# EAGLE design Sensors (EAGLE 9.6.2)
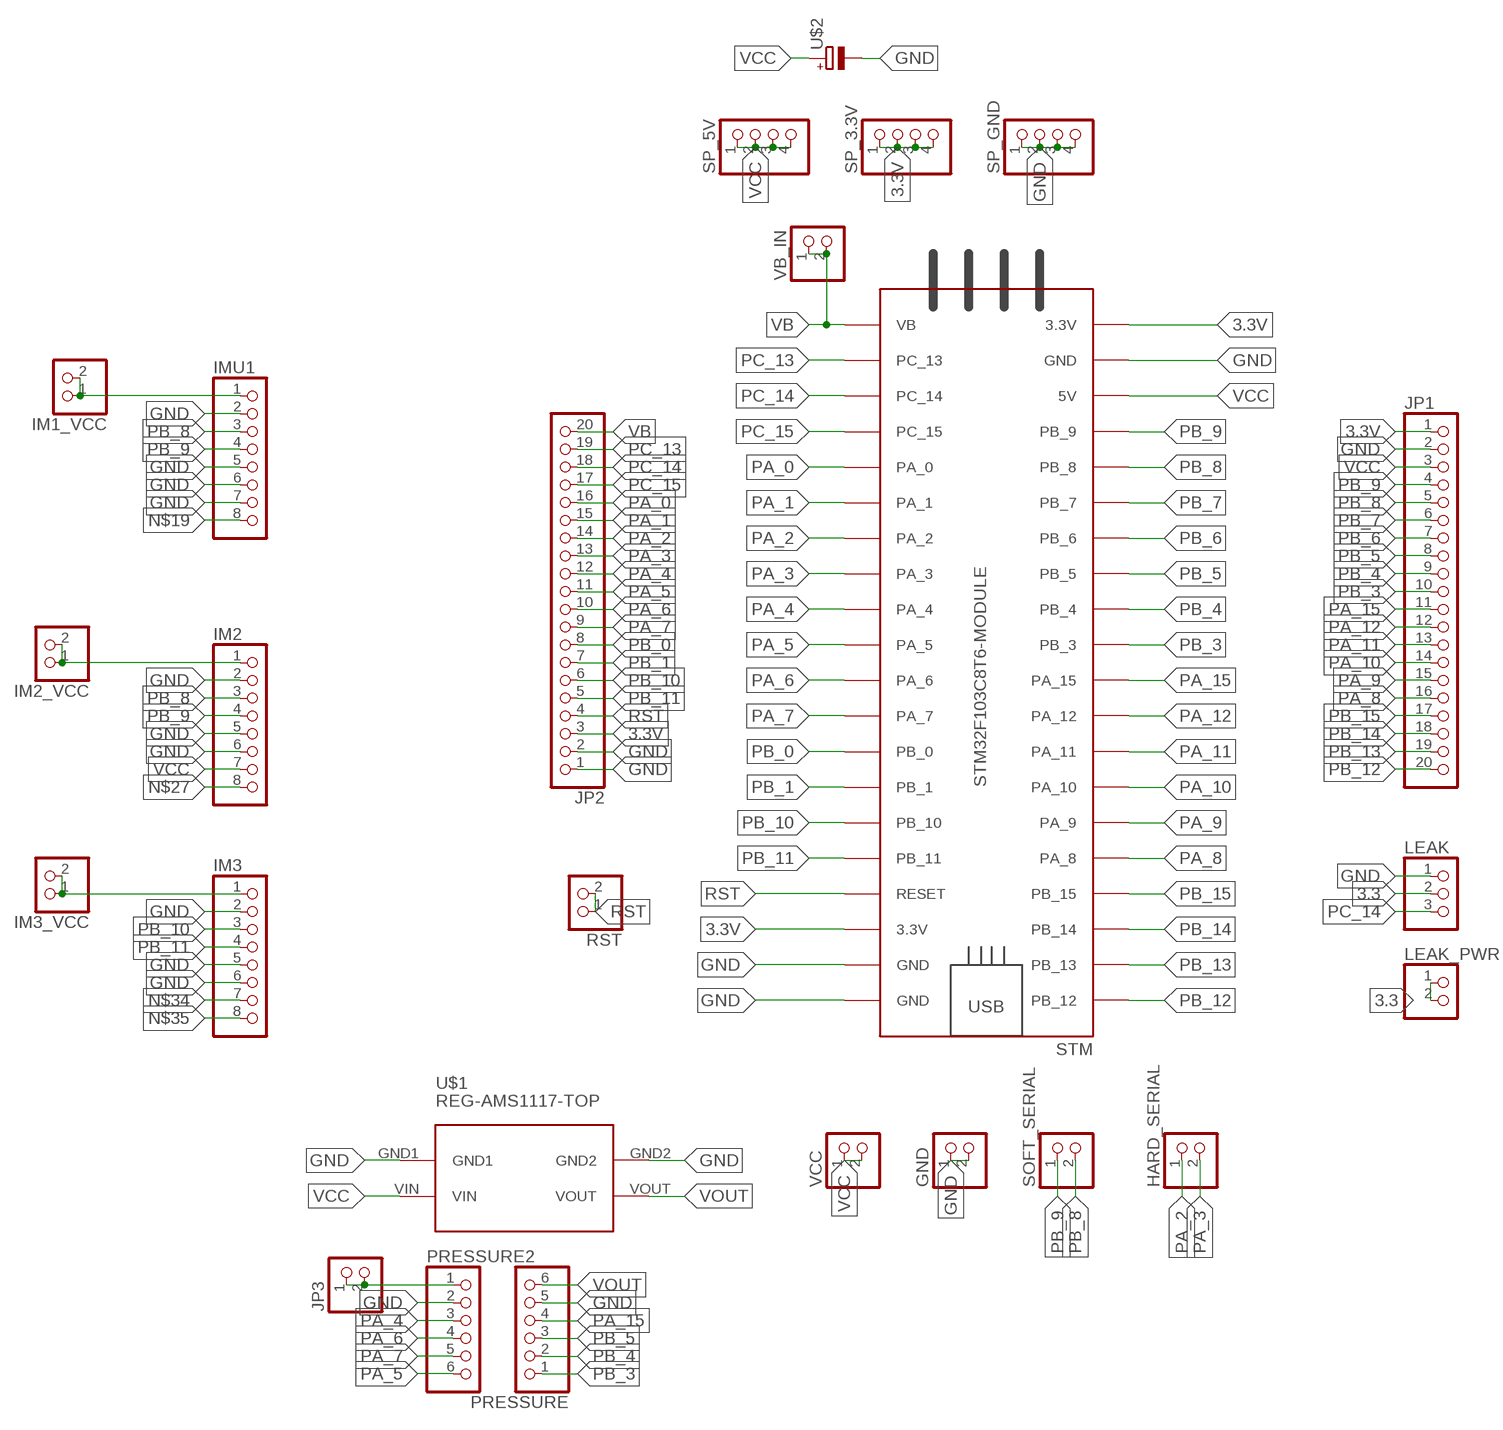
[diagram p0: schematic, sheet 1]

## Parts
GND  PINHD-2_DATA  [1X02_DATA]
HARD_SERIAL  PINHD-2_DATA  [1X02_DATA]
IM1_VCC  PINHD-2_DATA  [1X02_DATA]
IM2  PINHD-8_DATA  [1X08_DATA]
IM2_VCC  PINHD-2_DATA  [1X02_DATA]
IM3  PINHD-8_DATA  [1X08_DATA]
IM3_VCC  PINHD-2_DATA  [1X02_DATA]
IMU1  PINHD-8_DATA  [1X08_DATA]
JP1  PINHD-1X20  [1X20]
JP2  PINHD-1X20  [1X20]
JP3  PINHD-2_DATA  [1X02_DATA]
LEAK  PINHD-3_DATA  [1X03_DATA]
LEAK_PWR  PINHD-2_DATA  [1X02_DATA]
PRESSURE  PINHD-6_DATA  [1X06_DATA]
PRESSURE2  PINHD-6_DATA  [1X06_DATA]
RST  PINHD-2_DATA  [1X02_DATA]
SOFT_SERIAL  PINHD-2_DATA  [1X02_DATA]
SP_3.3V  PINHD-1X4  [1X04]
SP_5V  PINHD-1X4  [1X04]
SP_GND  PINHD-1X4  [1X04]
STM  STM32F103C8T6-MODULE  [STM32F103C8T6-MODULE]
U$1  REG-AMS1117-TOP  [REG-AMS1117_TOP]
U$2  CAP_POL  [E3,5-8]
VB_IN  PINHD-2_DATA  [1X02_DATA]
VCC  PINHD-2_DATA  [1X02_DATA]

## Nets
3.3: LEAK.2 LEAK_PWR.1 LEAK_PWR.2
3.3V: JP1.1 JP2.3 SP_3.3V.1 SP_3.3V.2 SP_3.3V.3 SP_3.3V.4 STM.3.3V_1(3.3V) STM.3.3V_2(3.3V)
GND: GND.1 GND.2 IM2.2 IM2.5 IM2.6 IM3.2 IM3.5 IM3.6 IMU1.2 IMU1.5 IMU1.6 IMU1.7 JP1.2 JP2.1 JP2.2 LEAK.1 PRESSURE2.2 PRESSURE.5 SP_GND.1 SP_GND.2 SP_GND.3 SP_GND.4 STM.GND_1(GND) STM.GND_2(GND) STM.GND_3(GND) U$1.GND1 U$1.GND2 U$2.-
N$2: IM2.1 IM2_VCC.1 IM2_VCC.2
N$3: IM1_VCC.1 IM1_VCC.2 IMU1.1
N$11: IM3.1 IM3_VCC.1 IM3_VCC.2
N$19: IMU1.8
N$27: IM2.8
N$34: IM3.7
N$35: IM3.8
NS: JP3.1 JP3.2 PRESSURE2.1
PA_0: JP2.16 STM.PA_0
PA_1: JP2.15 STM.PA_1
PA_2: HARD_SERIAL.1 JP2.14 STM.PA_2
PA_3: HARD_SERIAL.2 JP2.13 STM.PA_3
PA_4: JP2.12 PRESSURE2.3 STM.PA_4
PA_5: JP2.11 PRESSURE2.6 STM.PA_5
PA_6: JP2.10 PRESSURE2.4 STM.PA_6
PA_7: JP2.9 PRESSURE2.5 STM.PA_7
PA_8: JP1.16 STM.PA_8
PA_9: JP1.15 STM.PA_9
PA_10: JP1.14 STM.PA_10
PA_11: JP1.13 STM.PA_11
PA_12: JP1.12 STM.PA_12
PA_15: JP1.11 PRESSURE.4 STM.PA_15
PB_0: JP2.8 STM.PB_0
PB_1: JP2.7 STM.PB_1
PB_3: JP1.10 PRESSURE.1 STM.PB_3
PB_4: JP1.9 PRESSURE.2 STM.PB_4
PB_5: JP1.8 PRESSURE.3 STM.PB_5
PB_6: JP1.7 STM.PB_6
PB_7: JP1.6 STM.PB_7
PB_8: IM2.3 IMU1.3 JP1.5 SOFT_SERIAL.2 STM.PB_8
PB_9: IM2.4 IMU1.4 JP1.4 SOFT_SERIAL.1 STM.PB_9
PB_10: IM3.3 JP2.6 STM.PB_10
PB_11: IM3.4 JP2.5 STM.PB_11
PB_12: JP1.20 STM.PB_12
PB_13: JP1.19 STM.PB_13
PB_14: JP1.18 STM.PB_14
PB_15: JP1.17 STM.PB_15
PC_13: JP2.19 STM.PC_13
PC_14: JP2.18 LEAK.3 STM.PC_14
PC_15: JP2.17 STM.PC_15
RST: JP2.4 RST.1 RST.2 STM.RESET
VB: JP2.20 STM.VB VB_IN.1 VB_IN.2
VCC: IM2.7 JP1.3 SP_5V.1 SP_5V.2 SP_5V.3 SP_5V.4 STM.5V U$1.VIN U$2.+ VCC.1 VCC.2
VOUT: PRESSURE.6 U$1.VOUT

## Library data of the parts
GND HARD_SERIAL IM1_VCC IM2_VCC IM3_VCC JP3 LEAK_PWR RST SOFT_SERIAL VB_IN VCC = MIA_LIBRARY-2-2-2:PINHD-2_DATA: PIN HEADER
IM2 IM3 IMU1 = MIA_LIBRARY-2-2-2:PINHD-8_DATA: PIN HEADER
JP1 JP2 = MIA_LIBRARY-2-2-2:PINHD-1X20: PIN HEADER
LEAK = MIA_LIBRARY-2-2-2:PINHD-3_DATA: PIN HEADER
PRESSURE PRESSURE2 = MIA_LIBRARY-2-2-2:PINHD-6_DATA: PIN HEADER
SP_3.3V SP_5V SP_GND = MIA_LIBRARY-2-2-2:PINHD-1X4: PIN HEADER
STM = MIA_LIBRARY-2-2-2:STM32F103C8T6-MODULE: STM32F103C8T6 module with ARM Cortex-3, 20kB SRAM, 64kB Flash, 72MHz
U$1 = MIA_LIBRARY-2-2-2:REG-AMS1117-TOP: Linear Regulator based on AMS1117 chip
U$2 = MIA_LIBRARY-2-2-2:CAP_POL

## Board
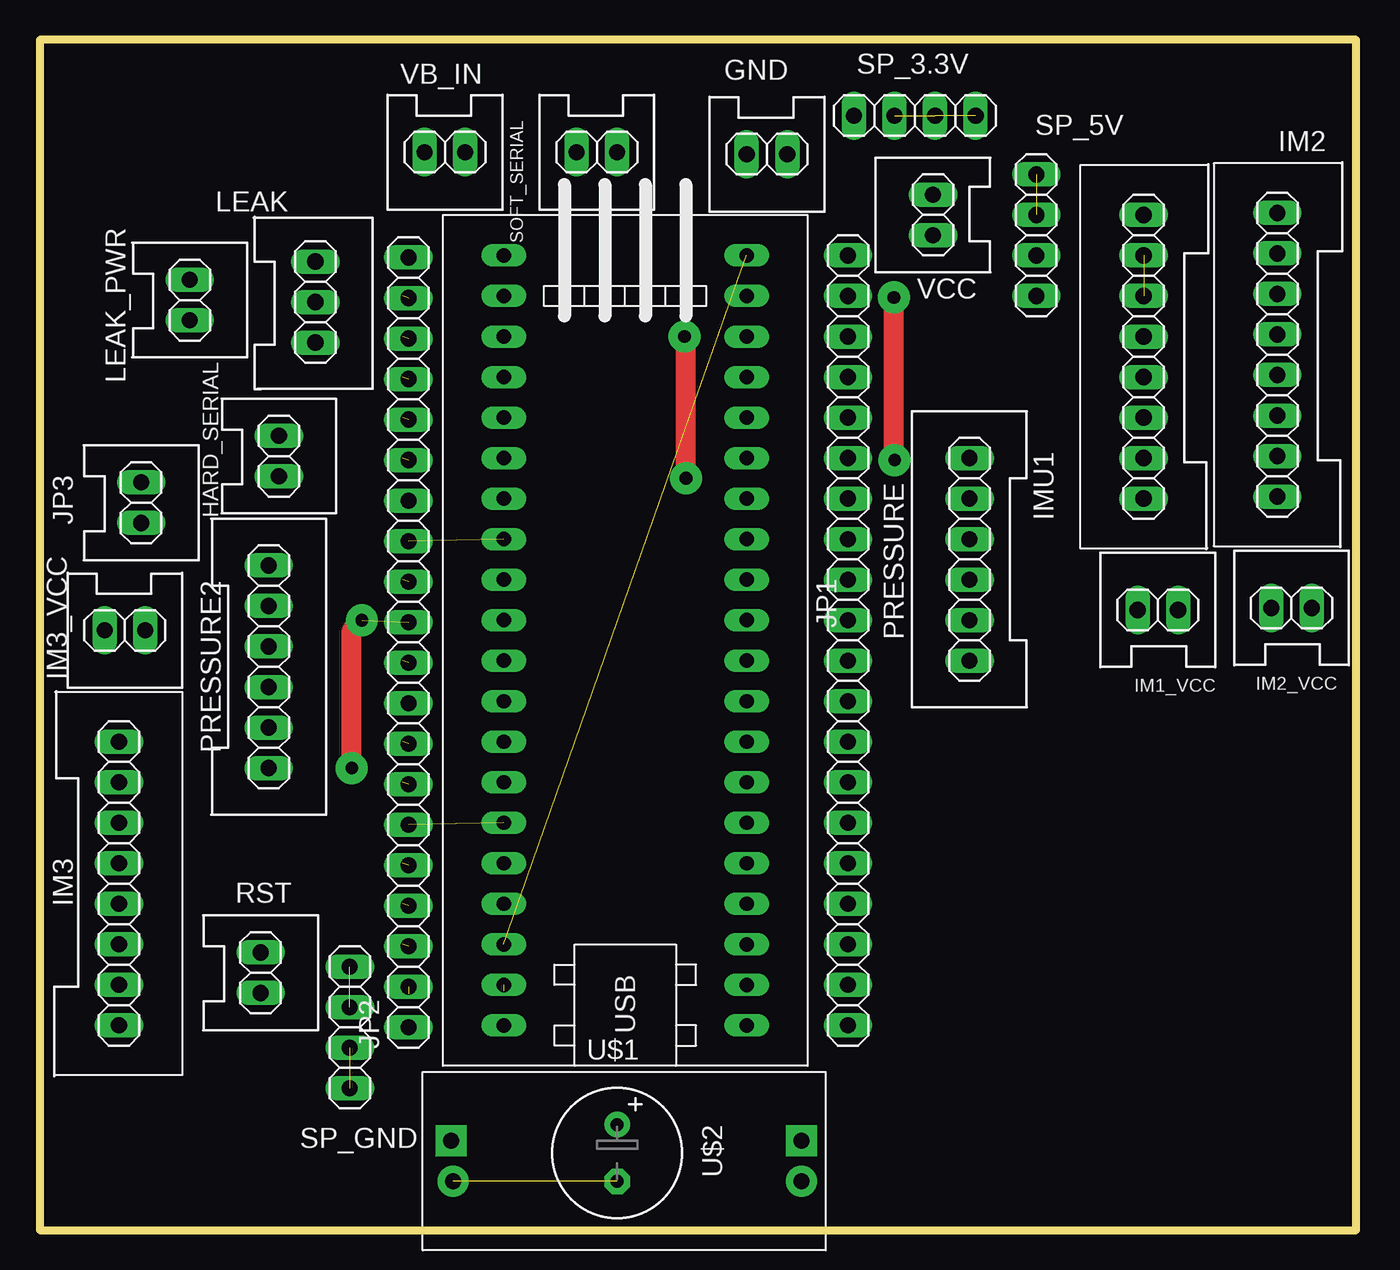
[diagram p1: board, top side]
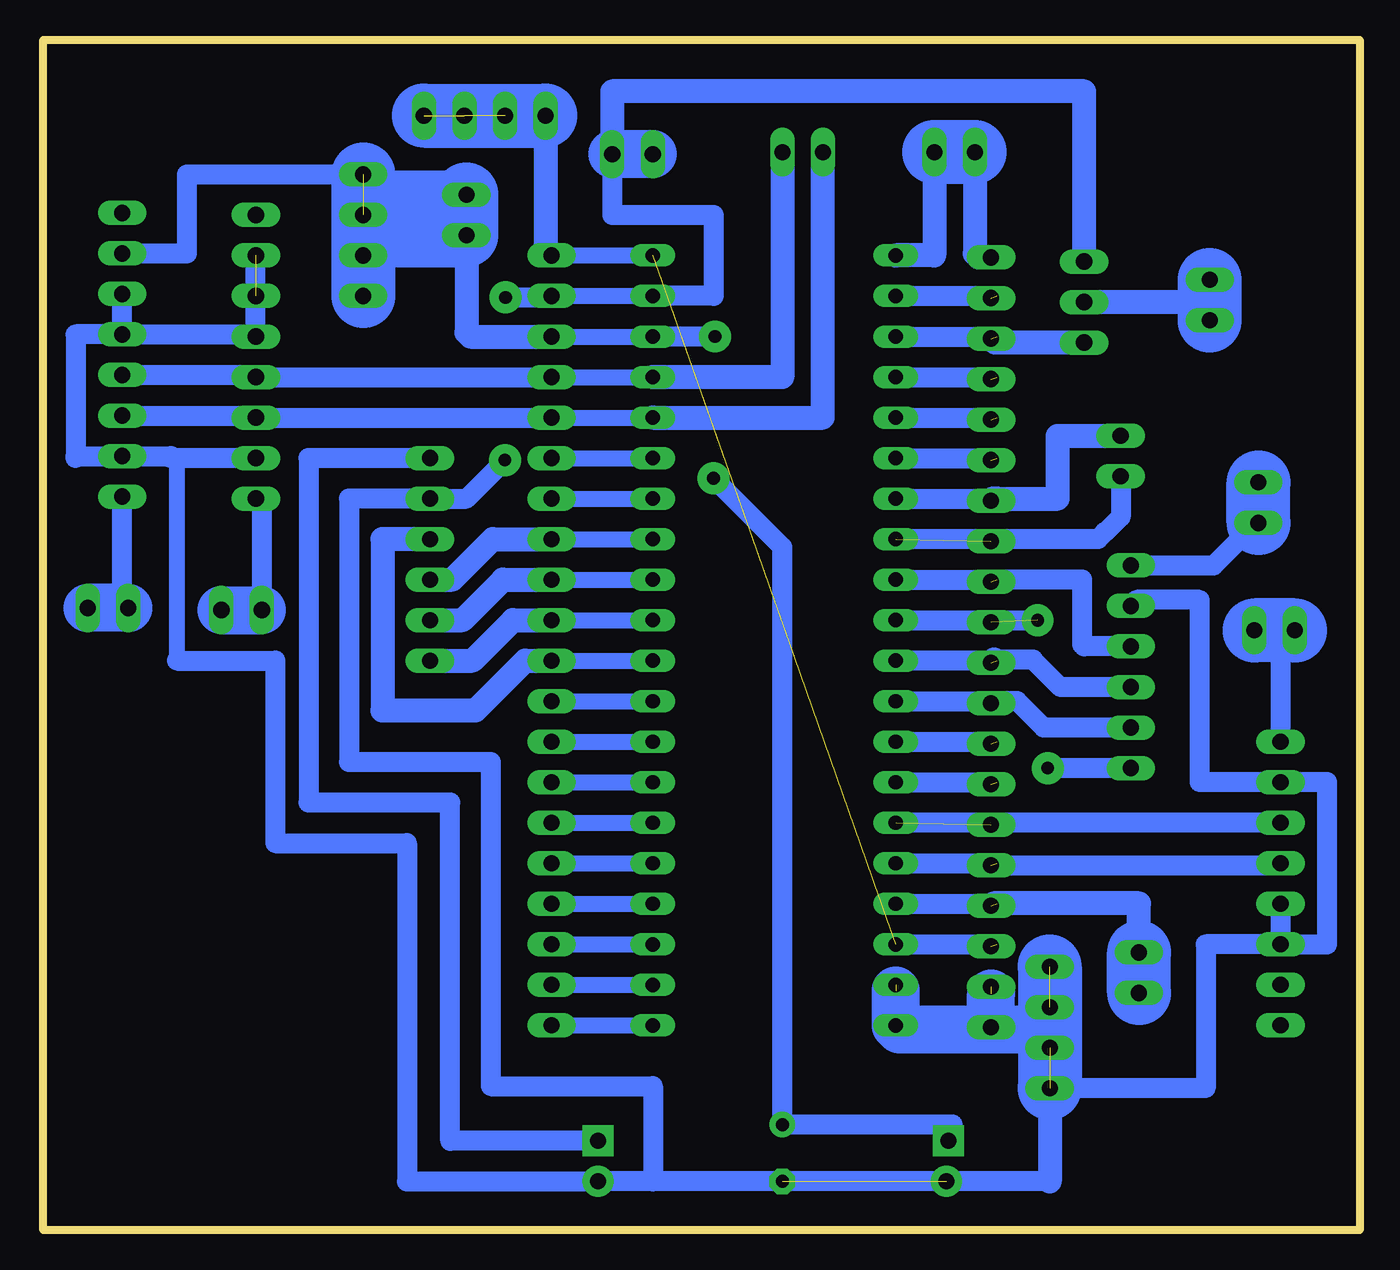
[diagram p2: board, bottom side, seen from below]

Size 82.53 x 74.6 mm. Coordinates in mm from the lower left corner, seen from the top.
Outline: 0,0 82.53,0 82.53,74.6 0,74.6 0,0
Copper layers (1*16): Top 0.035mm / dielectric 1.5mm / Bottom 0.035mm
Design rules "default *": minimum track width 1mm, minimum drill 0.35mm, track to track 0.7mm, track to pad 0.7mm, pad to pad 6mil, via to via 6mil, smd to smd 6mil, copper to edge 40mil, drill to drill 6mil, minimum pad ring 10mil, minimum via ring 8mil, stop-mask expansion 4mil, vias tented up to drill 0mil, thermal gap 10mil

### Footprints (pad centres in the part's own frame; a part is rotated, then mirrored left to right if it is on the bottom)
1X02_DATA = drill 1.016 long: 1 -1.27,0; 2 1.27,0
1X08_DATA = drill 1.016 long: 1 -8.89,0; 2 -6.35,0; 3 -3.81,0; 4 -1.27,0; 5 1.27,0; 6 3.81,0; 7 6.35,0; 8 8.89,0
1X20 = drill 1.016 long: 1 -24.13,0; 2 -21.59,0; 3 -19.05,0; 4 -16.51,0; 5 -13.97,0; 6 -11.43,0; 7 -8.89,0; 8 -6.35,0; 9 -3.81,0; 10 -1.27,0; 11 1.27,0; 12 3.81,0; 13 6.35,0; 14 8.89,0; 15 11.43,0; 16 13.97,0; 17 16.51,0; 18 19.05,0; 19 21.59,0; 20 24.13,0
1X03_DATA = drill 1.016 long: 1 -2.54,0; 2 0,0; 3 2.54,0
1X06_DATA = drill 1.016 long: 1 -6.35,0; 2 -3.81,0; 3 -1.27,0; 4 1.27,0; 5 3.81,0; 6 6.35,0
1X04 = drill 1.016 long: 1 -3.81,0; 2 -1.27,0; 3 1.27,0; 4 3.81,0
STM32F103C8T6-MODULE = drill 0.9 long: 3.3V_1 25.4,-7.62; 3.3V_2 -17.78,7.62; 5V 20.32,-7.62; GND_1 22.86,-7.62; GND_2 -20.32,7.62; GND_3 -22.86,7.62; PA_0 15.24,7.62; PA_1 12.7,7.62; PA_2 10.16,7.62; PA_3 7.62,7.62; PA_4 5.08,7.62; PA_5 2.54,7.62; PA_6 0,7.62; PA_7 -2.54,7.62; PA_8 -12.7,-7.62; PA_9 -10.16,-7.62; PA_10 -7.62,-7.62; PA_11 -5.08,-7.62; PA_12 -2.54,-7.62; PA_15 0,-7.62; PB_0 -5.08,7.62; PB_1 -7.62,7.62; PB_3 2.54,-7.62; PB_4 5.08,-7.62; PB_5 7.62,-7.62; PB_6 10.16,-7.62; PB_7 12.7,-7.62; PB_8 15.24,-7.62; PB_9 17.78,-7.62; PB_10 -10.16,7.62; PB_11 -12.7,7.62; PB_12 -22.86,-7.62; PB_13 -20.32,-7.62; PB_14 -17.78,-7.62; PB_15 -15.24,-7.62; PC_13 22.86,7.62; PC_14 20.32,7.62; PC_15 17.78,7.62; RESET -15.24,7.62; VB 25.4,7.62
REG-AMS1117_TOP = drill 1 pad 1.93: GND1 -13.843,-1.27; GND2 8.001,-1.27 | drill 1 pad 1.93 square: VIN -13.97,1.27; VOUT 8.001,1.27
E3,5-8 = drill 0.813 pad 1.6: + -1.778,0 | drill 0.813 pad 1.6 octagon: - 1.778,0

### Placement (x,y rotation side)
GND  45.59,67.44 180 top
HARD_SERIAL  14.99,48.51 270 top
IM1_VCC  70.1,38.86 0 top
IM2  77.6,54.86 90 top
IM2_VCC  78.49,38.99 0 top
IM3  4.95,21.72 270 top
IM3_VCC  5.33,37.59 180 top
IMU1  69.22,54.74 90 top
JP1  50.67,36.96 270 top
JP2  23.11,36.83 90 top
JP3  6.35,45.59 270 top
LEAK  17.27,58.17 270 top
LEAK_PWR  9.4,58.29 270 top
PRESSURE  58.29,42.04 90 top
PRESSURE2  14.35,35.31 270 top
RST  13.84,16.13 270 top
SOFT_SERIAL  34.92,67.56 180 top
SP_3.3V  54.86,69.85 180 top
SP_5V  62.48,62.36 90 top
SP_GND  19.43,12.7 90 top
STM  36.7,35.69 90 top
U$1  39.75,4.32 0 top
U$2  36.2,4.83 270 top
VB_IN  25.4,67.56 180 top
VCC  56.01,63.63 90 top

### Tracks (layer width: path | path; a pad name or v marks a point on that pad's centre or on a via)
3.3
  Bottom 1.5: LEAK_PWR.1 9.4,58.17 LEAK.2
  Bottom 4: LEAK_PWR.2 LEAK_PWR.1
3.3V  (4 unrouted)
  Bottom 1: JP1.1 STM.3.3V_1
  Bottom 1.25: STM.3.3V_2 22.73,17.91
  Bottom 1.5: SP_3.3V.4 51.05,61.47 JP1.1
  Bottom 4: SP_3.3V.1 SP_3.3V.4
GND  (via drill 0.8 pad 2)  (6 unrouted)
  Top 1.25: v53.59,48.26 53.56,48.3 v53.56,58.46
  Bottom 1: JP1.2 STM.GND_1 | 74.55,48.51 74.55,48.39 | 74.17,48.39 74.17,35.69
  Bottom 1.25: 19.43,3.05 U$1.GND1 44.32,3.05 | 44.32,3.05 U$1.GND2 59.73,3.05 59.73,24.26 67.99,24.26 67.99,35.69 74.17,35.69 | 44.32,3.05 44.32,9.02 54.48,9.02 54.48,29.34 63.37,29.34 63.37,45.85 PRESSURE.5 56.01,45.85 v53.59,48.26 | IMU1.2 74.17,48.39 74.55,48.39 | IMU1.7 IMU1.5 69.34,56.13 IM2.5 | 74.55,48.51 IM2.2 80.52,48.51 | IM2.5 IM2.6 | IM2.5 80.52,56.13 80.52,48.39 | IM3.6 IM3.5 | IM3.6 2.03,17.91 2.03,28.07 IM3.2 10.03,28.07 10.03,39.5 13.97,39.5 PRESSURE2.2 | IM3.6 9.65,17.91 9.65,8.89 SP_GND.1 | GND.1 46.86,63.63 40.51,63.63 40.51,58.55 STM.GND_1 | v53.56,58.46 50.76,58.46 JP1.2
  Bottom 1.5: SP_GND.1 19.43,3.05 | LEAK.1 17.27,71.37 46.86,71.37 GND.1
  Bottom 3: SP_GND.2 20.57,12.57 20.57,12.7 20.45,12.57 22.99,12.57 | 22.99,12.57 JP2.1 23.11,14.82 | 22.99,12.57 28.83,12.57 STM.GND_3 29.08,15 | GND.2 GND.1
  Bottom 4: SP_GND.4 SP_GND.1
N$2
  Bottom 1.25: IM2_VCC.2 77.6,38.99 IM2.1
  Bottom 3: IM2_VCC.1 IM2_VCC.2
N$3
  Bottom 1.25: IMU1.1 68.83,45.47 IM1_VCC.1
  Bottom 3: IM1_VCC.2 IM1_VCC.1
N$11
  Bottom 1.25: IM3.1 4.95,36.7 IM3_VCC.2
  Bottom 4: IM3_VCC.2 IM3_VCC.1
NS
  Bottom 1.25: PRESSURE2.1 9.14,41.66 6.48,44.32 JP3.2 6.22,44.45 6.22,44.58 6.35,44.7 JP3.1
  Bottom 4: JP3.2 JP3.1
PA_0  (1 unrouted)
  Bottom 1.25: STM.PA_0 22.73,50.93
PA_1  (1 unrouted)
  Bottom 1.25: STM.PA_1 22.73,48.39
PA_2
  Bottom 1.25: STM.PA_2 22.73,45.85
  Bottom 1.5: JP2.14 22.99,45.85 22.73,45.85 18.92,45.85 18.92,49.78 HARD_SERIAL.1
PA_3  (1 unrouted)
  Bottom 1.25: HARD_SERIAL.2 14.99,44.7 15.95,43.74 15.98,43.74 16.41,43.31 STM.PA_3
PA_4  (1 unrouted)
  Bottom 1.25: STM.PA_4 22.73,40.77 | PRESSURE2.3 17.27,36.58 17.4,36.7 17.4,40.77 22.99,40.77 JP2.12
PA_5  (via drill 0.8 pad 2)  (1 unrouted)
  Top 1.25: v19.56,28.96 19.56,37.59 v20.19,38.23
  Bottom 1.25: STM.PA_5 v20.19,38.23 | PRESSURE2.6 v19.56,28.96
PA_6  (1 unrouted)
  Bottom 1.25: 14.42,34.11 PRESSURE2.4 18.76,34.04 20.47,35.75 22.92,35.75 | 22.73,35.69 STM.PA_6
  Bottom 1.5: 22.92,35.75 JP2.10
PA_7
  Bottom 1.25: 22.99,33.15 JP2.9 | 22.99,33.15 21.46,33.15 19.81,31.5 PRESSURE2.5 | STM.PA_7 22.99,33.15
PA_8
  Bottom 1: JP1.16 STM.PA_8
PA_9
  Bottom 1: JP1.15 STM.PA_9
PA_10
  Bottom 1: JP1.14 STM.PA_10
PA_11
  Bottom 1: JP1.13 STM.PA_11
PA_12
  Bottom 1: JP1.12 STM.PA_12
PA_15
  Bottom 1: JP1.11 STM.PA_15
  Bottom 1.5: JP1.11 52.32,35.69 55.45,32.56 61.27,32.56 61.27,43.31 PRESSURE.4
PB_0  (1 unrouted)
  Bottom 1.25: STM.PB_0 22.73,30.61
PB_1  (1 unrouted)
  Bottom 1.25: STM.PB_1 22.73,28.07
PB_3
  Bottom 1: JP1.10 STM.PB_3
  Bottom 1.5: PRESSURE.1 55.63,35.69 53.09,38.23 JP1.10
PB_4
  Bottom 1: JP1.9 STM.PB_4
  Bottom 1.5: PRESSURE.2 56.26,38.23 53.72,40.77 JP1.9
PB_5
  Bottom 1: JP1.8 STM.PB_5
  Bottom 1.5: PRESSURE.3 56.9,40.77 54.36,43.31 JP1.8
PB_6
  Bottom 1: JP1.7 STM.PB_6
PB_7
  Bottom 1: JP1.6 STM.PB_7
PB_8
  Bottom 1: JP1.5 STM.PB_8
  Bottom 1.25: JP1.5 IMU1.3 69.34,51.05 IM2.3
  Bottom 1.5: STM.PB_8 33.66,50.93 SOFT_SERIAL.2
PB_9
  Bottom 1: JP1.4 STM.PB_9
  Bottom 1.25: JP1.4 IMU1.4 69.34,53.59 IM2.4
  Bottom 1.5: SOFT_SERIAL.1 36.2,53.47 STM.PB_9
PB_10  (1 unrouted)
  Bottom 1.25: IM3.3 STM.PB_10
PB_11  (1 unrouted)
  Bottom 1.25: STM.PB_11 22.73,22.99 | JP2.5 5.08,22.86 IM3.4
PB_12
  Bottom 1: JP1.20 STM.PB_12
PB_13
  Bottom 1: JP1.19 STM.PB_13
PB_14
  Bottom 1: JP1.18 STM.PB_14
PB_15
  Bottom 1: JP1.17 STM.PB_15
PC_13  (1 unrouted)
  Bottom 1.25: STM.PC_13 22.73,58.55
PC_14  (1 unrouted)
  Bottom 1.25: STM.PC_14 22.73,56.01
  Bottom 1.5: LEAK.3 22.86,55.63 JP2.18
PC_15  (1 unrouted)
  Bottom 1.25: STM.PC_15 22.73,53.47
RST  (1 unrouted)
  Bottom 1.25: STM.RESET 22.73,20.45
  Bottom 1.5: JP2.4 22.96,20.48 13.84,20.48 RST.1
  Bottom 4: RST.2 RST.1
VB
  Bottom 1.5: VB_IN.1 26.67,61.09 STM.VB | VB_IN.2 24.13,61.21 23.88,60.96 JP2.20
  Bottom 4: VB_IN.2 VB_IN.1
VCC  (via drill 0.8 pad 2)  (1 unrouted)
  Top 1.25: v40.51,47.12 40.51,55.92 v40.42,56.01
  Bottom 1: JP1.3 STM.5V
  Bottom 1.25: U$1.VIN 25.78,6.35 25.53,6.6 U$2.+ 36.2,42.8 v40.51,47.12 | IM2.7 73.53,61.21 73.53,66.17 SP_5V.4 | v40.42,56.01 STM.5V
  Bottom 1.5: VCC.1 56.01,56.26 55.75,56.01 JP1.3 | 62.48,62.36 SP_5V.2 | SP_5V.2 SP_5V.1 | VCC.2 56.01,61.26 56.47,61.09 SP_5V.2
  Bottom 3: VCC.2 61.21,64.9 SP_5V.4 | VCC.1 62.48,62.36
  Bottom 4: SP_5V.4 62.48,62.36 SP_5V.1 | VCC.1 VCC.2
VOUT
  Bottom 1.25: PRESSURE.6 65.91,48.39 65.91,26.8 57.02,26.8 57.02,5.59 U$1.VOUT